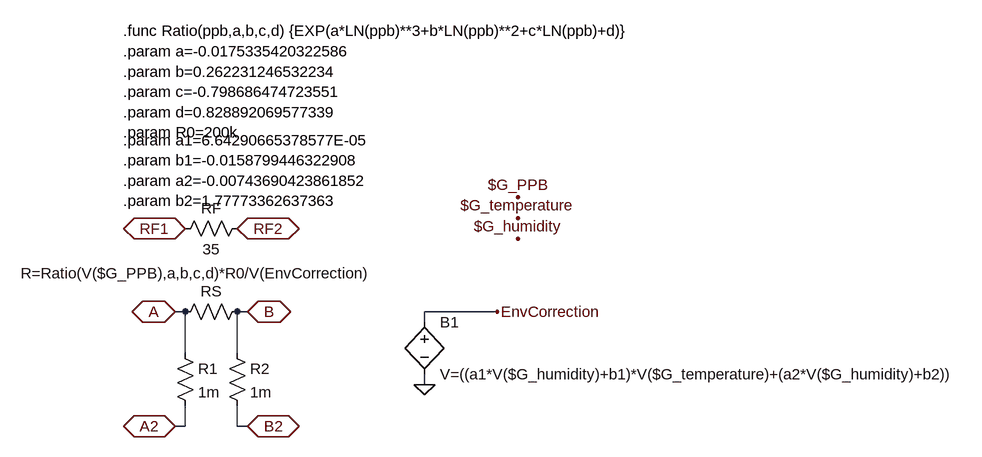
[diagram p0: schematic MQ131L.asc]
MQ131L.asc, the LTspice schematic file:
Version 4
SHEET 1 1380 680
WIRE 80 -96 64 -96
WIRE 176 -96 160 -96
WIRE 560 -96 448 -96
WIRE 448 -80 448 -96
WIRE 80 -32 80 -96
WIRE 160 -32 160 -96
WIRE 448 16 448 0
WIRE 80 80 80 48
WIRE 80 80 64 80
WIRE 160 80 160 48
WIRE 176 80 160 80
FLAG 64 -96 A
IOPIN 64 -96 BiDir
FLAG 176 -96 B
IOPIN 176 -96 BiDir
FLAG 64 80 A2
IOPIN 64 80 BiDir
FLAG 176 80 B2
IOPIN 176 80 BiDir
FLAG 80 -224 RF1
IOPIN 80 -224 BiDir
FLAG 160 -224 RF2
IOPIN 160 -224 BiDir
FLAG 592 -240 $G_temperature
FLAG 592 -208 $G_humidity
FLAG 592 -272 $G_PPB
FLAG 448 16 0
FLAG 560 -96 EnvCorrection
SYMBOL res 64 -80 R270
WINDOW 0 32 56 VTop 2
WINDOW 3 91 33 VBottom 2
SYMATTR InstName RS
SYMATTR Value R=Ratio(V($G_PPB),a,b,c,d)*R0/V(EnvCorrection)
SYMBOL res 176 -240 R90
WINDOW 0 0 56 VBottom 2
WINDOW 3 32 56 VTop 2
SYMATTR InstName RF
SYMATTR Value 35
SYMBOL res 64 -48 R0
SYMATTR InstName R1
SYMATTR Value 1m
SYMBOL res 144 -48 R0
SYMATTR InstName R2
SYMATTR Value 1m
SYMBOL bv 448 -96 R0
SYMATTR InstName B1
SYMATTR Value V=((a1*V($G_humidity)+b1)*V($G_temperature)+(a2*V($G_humidity)+b2))
TEXT -16 -360 Left 2 !.param a1=6.64290665378577E-05\n.param b1=-0.0158799446322908\n.param a2=-0.00743690423861852\n.param b2=1.77773362637363
TEXT -16 -528 Left 2 !.func Ratio(ppb,a,b,c,d) {EXP(a*LN(ppb)**3+b*LN(ppb)**2+c*LN(ppb)+d)}\n.param a=-0.0175335420322586\n.param b=0.262231246532234\n.param c=-0.798686474723551\n.param d=0.828892069577339\n.param R0=200k

The netlist it stands for:
* MQ131L.asc
RS A B R=Ratio(V($G_PPB),a,b,c,d)*R0/V(EnvCorrection)
RF RF2 RF1 35
R1 A A2 1m
R2 B B2 1m
B1 EnvCorrection 0 V=((a1*V($G_humidity)+b1)*V($G_temperature)+(a2*V($G_humidity)+b2))
.param a1=6.64290665378577E-05
.param b1=-0.0158799446322908
.param a2=-0.00743690423861852
.param b2=1.77773362637363
.func Ratio(ppb,a,b,c,d) {EXP(a*LN(ppb)**3+b*LN(ppb)**2+c*LN(ppb)+d)}
.param a=-0.0175335420322586
.param b=0.262231246532234
.param c=-0.798686474723551
.param d=0.828892069577339
.param R0=200k
.backanno
.end